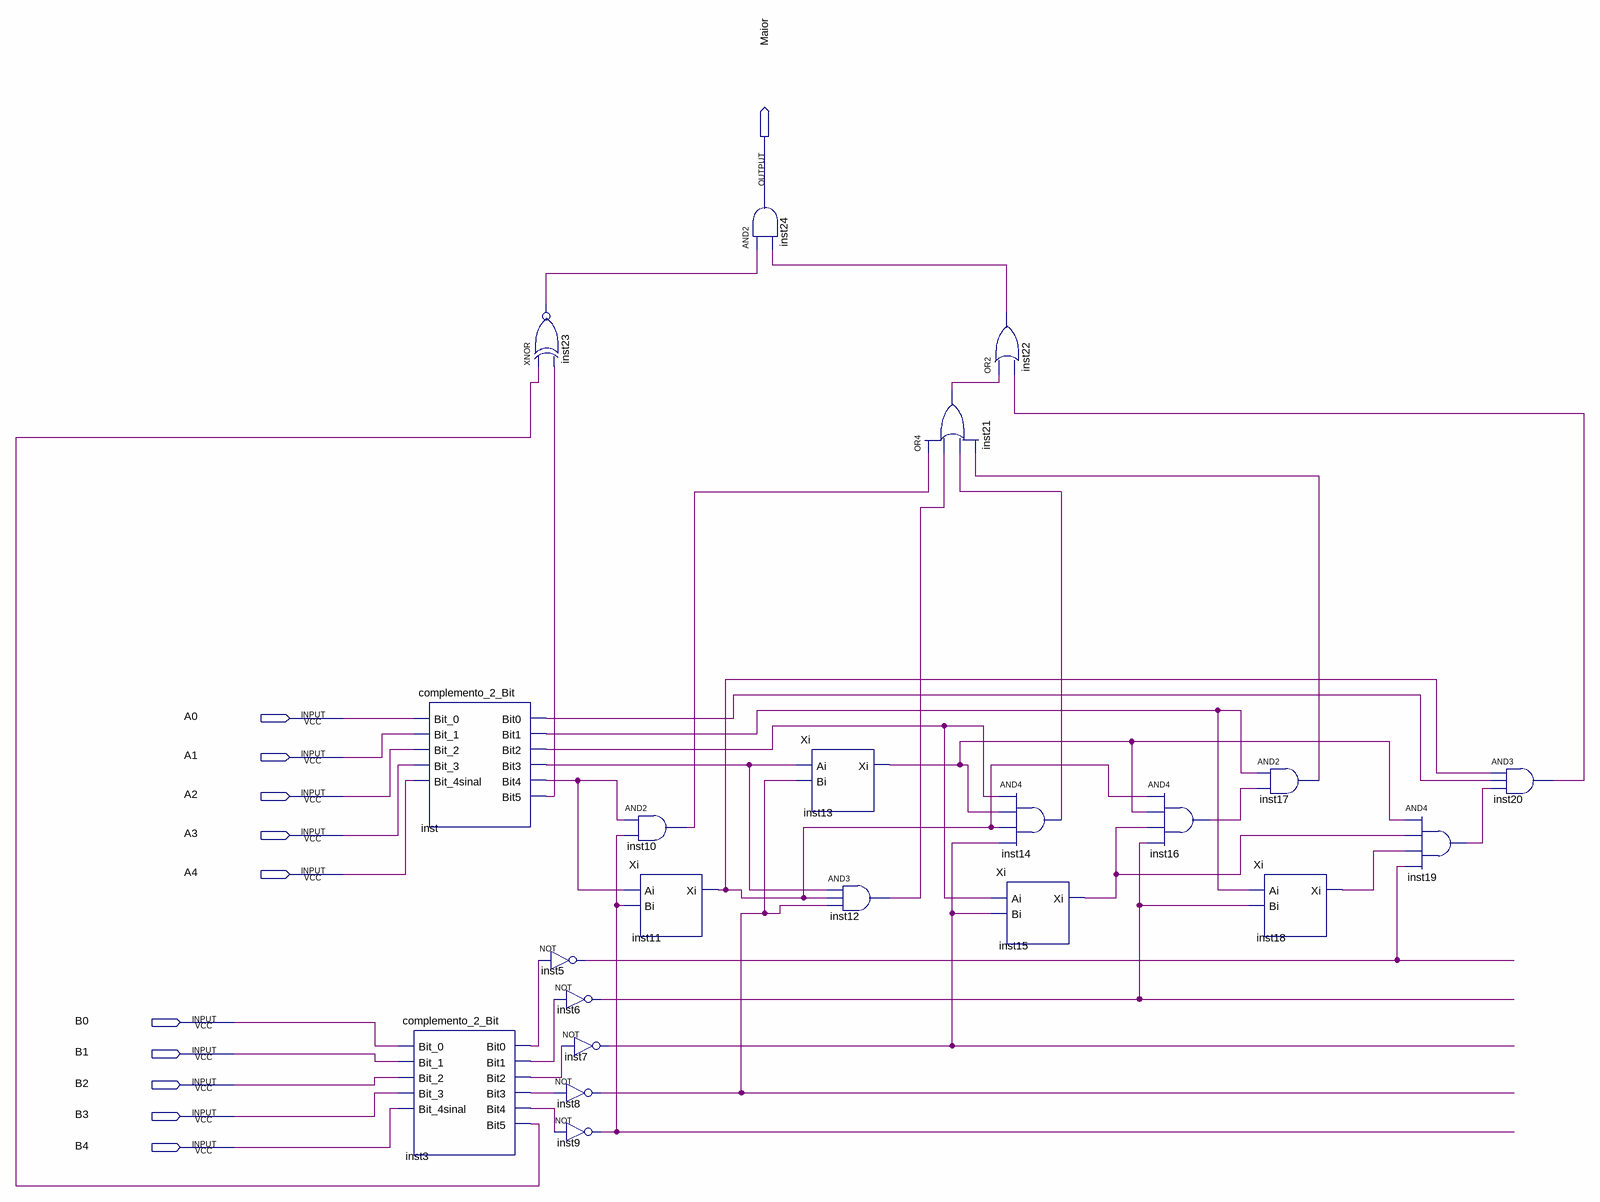
[diagram p0: schematic sheet]
// Quartus schematic comparador_logico_maior.bdf as structural Verilog: 22 symbols, 11 pins
module comparador_logico_maior (
  input  A0,
  input  A1,
  input  A2,
  input  A3,
  input  A4,
  input  B0,
  input  B1,
  input  B2,
  input  B3,
  input  B4,
  output Maior
);

  wire inst3_bit0, inst3_bit1, inst3_bit2, inst3_bit3, inst3_bit4, inst3_bit5, inst5_out, inst6_out,
       inst7_out, inst8_out, inst9_out, inst10_out, inst11_xi, inst12_out, inst13_xi, inst14_out, inst15_xi,
       inst16_out, inst17_out, inst18_xi, inst19_out, inst20_out, inst21_out, inst22_out, inst23_out,
       inst_bit0, inst_bit1, inst_bit2, inst_bit3, inst_bit4, inst_bit5;

  complemento_2_Bit inst (
    .Bit_0(A0), .Bit_1(A1), .Bit_2(A2), .Bit_3(A3), .Bit_4sinal(A4), .Bit0(inst_bit0), .Bit1(inst_bit1),
    .Bit2(inst_bit2), .Bit3(inst_bit3), .Bit4(inst_bit4), .Bit5(inst_bit5));
  complemento_2_Bit inst3 (
    .Bit_0(B0), .Bit_1(B1), .Bit_2(B2), .Bit_3(B3), .Bit_4sinal(B4), .Bit0(inst3_bit0), .Bit1(inst3_bit1),
    .Bit2(inst3_bit2), .Bit3(inst3_bit3), .Bit4(inst3_bit4), .Bit5(inst3_bit5));
  xnor inst23 (inst23_out, inst3_bit5, inst_bit5);
  not inst5 (inst5_out, inst3_bit0);
  not inst6 (inst6_out, inst3_bit1);
  not inst7 (inst7_out, inst3_bit2);
  not inst8 (inst8_out, inst3_bit3);
  not inst9 (inst9_out, inst3_bit4);
  and inst10 (inst10_out, inst_bit4, inst9_out);
  Xi inst11 (.Ai(inst_bit4), .Bi(inst9_out), .Xi(inst11_xi));
  and inst24 (Maior, inst23_out, inst22_out);
  Xi inst13 (.Ai(inst_bit3), .Bi(inst8_out), .Xi(inst13_xi));
  and inst12 (inst12_out, inst_bit3, inst11_xi, inst8_out);
  or inst21 (inst21_out, inst10_out, inst12_out, inst14_out, inst17_out);
  or inst22 (inst22_out, inst21_out, inst20_out);
  and inst14 (inst14_out, inst_bit2, inst13_xi, inst11_xi, inst7_out);
  Xi inst15 (.Ai(inst_bit2), .Bi(inst7_out), .Xi(inst15_xi));
  and inst16 (inst16_out, inst11_xi, inst13_xi, inst15_xi, inst6_out);
  Xi inst18 (.Ai(inst_bit1), .Bi(inst6_out), .Xi(inst18_xi));
  and inst17 (inst17_out, inst_bit1, inst16_out);
  and inst19 (inst19_out, inst13_xi, inst15_xi, inst18_xi, inst5_out);
  and inst20 (inst20_out, inst11_xi, inst_bit0, inst19_out);
endmodule
